# Altium schematic sheet Signal_Pow_Reg_SCH.SchDoc
size A
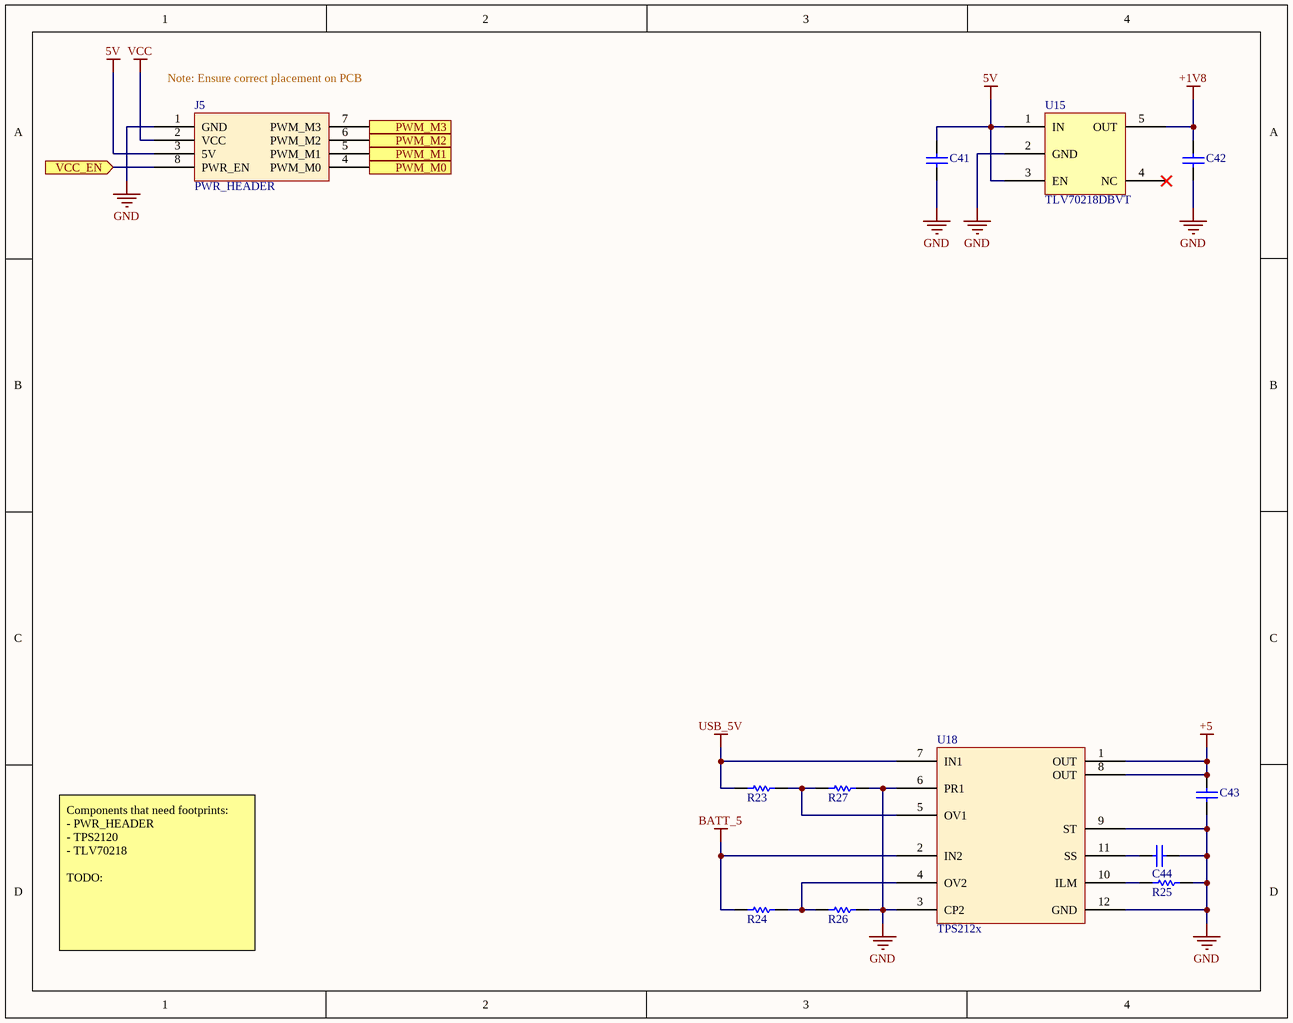
[diagram p0: Signal_Pow_Reg_SCH.SchDoc]

## Parts
C41  08055C104KAJ2A  [CAPC2013X140X50NL20T25]  (value not drawn)
C42  08055C104KAJ2A  [CAPC2013X140X50NL20T25]  (value not drawn)
C43  08055C104KAJ2A  [CAPC2013X140X50NL20T25]  (value not drawn)
C44  08055C104KAJ2A  [CAPC2013X140X50NL20T25]  (value not drawn)
J5  PWR_HEADER
R23  ERJ-6ENF1503V  [RESC2013X70X40LL20T20]  (value not drawn)
R24  ERJ-6ENF1503V  [RESC2013X70X40LL20T20]  (value not drawn)
R25  ERJ-6ENF1503V  [RESC2013X70X40LL20T20]  (value not drawn)
R26  ERJ-6ENF1503V  [RESC2013X70X40LL20T20]  (value not drawn)
R27  ERJ-6ENF1503V  [RESC2013X70X40LL20T20]  (value not drawn)
U15  TLV70218DBVT
U18  TPS212x

## Ports
PWM_M0 (in), PWM_M1 (in), PWM_M2 (in), PWM_M3 (in), VCC_EN (in)

## Nets
5V: C41.2 J5.3(5V) U15.1(IN) U15.3(EN)
+1V8: C42.2 U15.5(OUT)
+5: C43.2 U18.1(OUT) U18.8(OUT)
BATT_5: R24.2 U18.2(IN2)
GND: C41.1 C42.1 C43.1 C44.2 J5.1(GND) R25.2 R26.2 R27.2 U15.2(GND) U18.3(CP2) U18.6(PR1) U18.9(ST) U18.12(GND)
USB_5V: R23.2 U18.7(IN1)
VCC: J5.2(VCC)
PWM_M0: J5.4(PWM_M0) ; port PWM_M0
PWM_M1: J5.5(PWM_M1) ; port PWM_M1
PWM_M2: J5.6(PWM_M2) ; port PWM_M2
PWM_M3: J5.7(PWM_M3) ; port PWM_M3
VCC_EN: J5.8(PWR_EN) ; port VCC_EN
NetC44_1: C44.1 U18.11(SS)
NetR23_1: R23.1 R27.1 U18.5(OV1)
NetR24_1: R24.1 R26.1 U18.4(OV2)
NetR25_1: R25.1 U18.10(ILM)

Not connected (* = marked no-connect by the designer): U15 4(NC)*

## Notes on the sheet
- (near J5) Note: Ensure correct placement on PCB
- Components that need footprints:
  - PWR_HEADER
  - TPS2120
  - TLV70218
  TODO:

## Library data of the parts
C41 C42 = CMP-2007-04765-1: Manufacturer: AVX Interconnect / Elco; Value: 1u; Part Number: 08055C104KAJ2A
C43 = CMP-2007-04765-1: Manufacturer: AVX Interconnect / Elco; Value: 100u; Part Number: 08055C104KAJ2A
C44 = CMP-2007-04765-1: Manufacturer: AVX Interconnect / Elco; Value: 0.01u; Part Number: 08055C104KAJ2A
R23 R24 = CMP-2001-04440-2: RES SMD 150K OHM 1% 1/8W 0805; Manufacturer: Panasonic; Value: 23.7k; Datasheet: http://industrial.panasonic.com/cdbs/www-data/pdf/RDA0000/AOA0000C86.pdf; Part Number: ERJ-6ENF1503V
R25 = CMP-2001-04440-2: RES SMD 150K OHM 1% 1/8W 0805; Manufacturer: Panasonic; Value: 51.1k; Datasheet: http://industrial.panasonic.com/cdbs/www-data/pdf/RDA0000/AOA0000C86.pdf; Part Number: ERJ-6ENF1503V
R26 R27 = CMP-2001-04440-2: RES SMD 150K OHM 1% 1/8W 0805; Manufacturer: Panasonic; Value: 5k; Datasheet: http://industrial.panasonic.com/cdbs/www-data/pdf/RDA0000/AOA0000C86.pdf; Part Number: ERJ-6ENF1503V
U15 = TLV702
U18 = TPS212x: PWR MGMT BATTERY MGMT